# Altium schematic sheet CC3000EM.SchDoc
size A
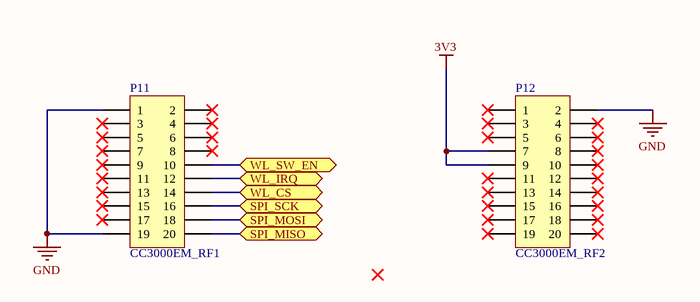
[diagram p0: CC3000EM.SchDoc]

## Parts
P11  CC3000EM_RF1  [MHDR2X10]
P12  CC3000EM_RF2  [MHDR2X10]

## Ports
SPI_MISO, SPI_MOSI, SPI_SCK, WL_CS, WL_IRQ, WL_SW_EN

## Nets
3V3: P12.7 P12.9
GND: P11.1 P11.19 P12.2
SPI_MISO: P11.20 ; port SPI_MISO
SPI_MOSI: P11.18 ; port SPI_MOSI
SPI_SCK: P11.16 ; port SPI_SCK
WL_CS: P11.14 ; port WL_CS
WL_IRQ: P11.12 ; port WL_IRQ
WL_SW_EN: P11.10 ; port WL_SW_EN

Not connected (* = marked no-connect by the designer): P11 2* 3* 4* 5* 6* 7* 8* 9* 11* 13* 15* 17*; P12 1* 3* 4* 5* 6* 8* 10* 11* 12* 13* 14* 15* 16* 17* 18* 19* 20*

## Library data of the parts
P11 P12 = Header 10X2: Header, 10-Pin, Dual row; Supplier 1: Digi-Key; Supplier Part Number 1: SAM8705-ND